# EasyEDA Pro project MSDRV4.eprj, schematic Schematic1_1
Board Name: Board1_1; Create Date: 2025-01-27; Page Name: P1; Project Name: MSDRV4; Schematic Name: Schematic1_1; Update Date: 2025-03-06; Company: EasyEDA.com; Page Size: A4; Version: V1.0
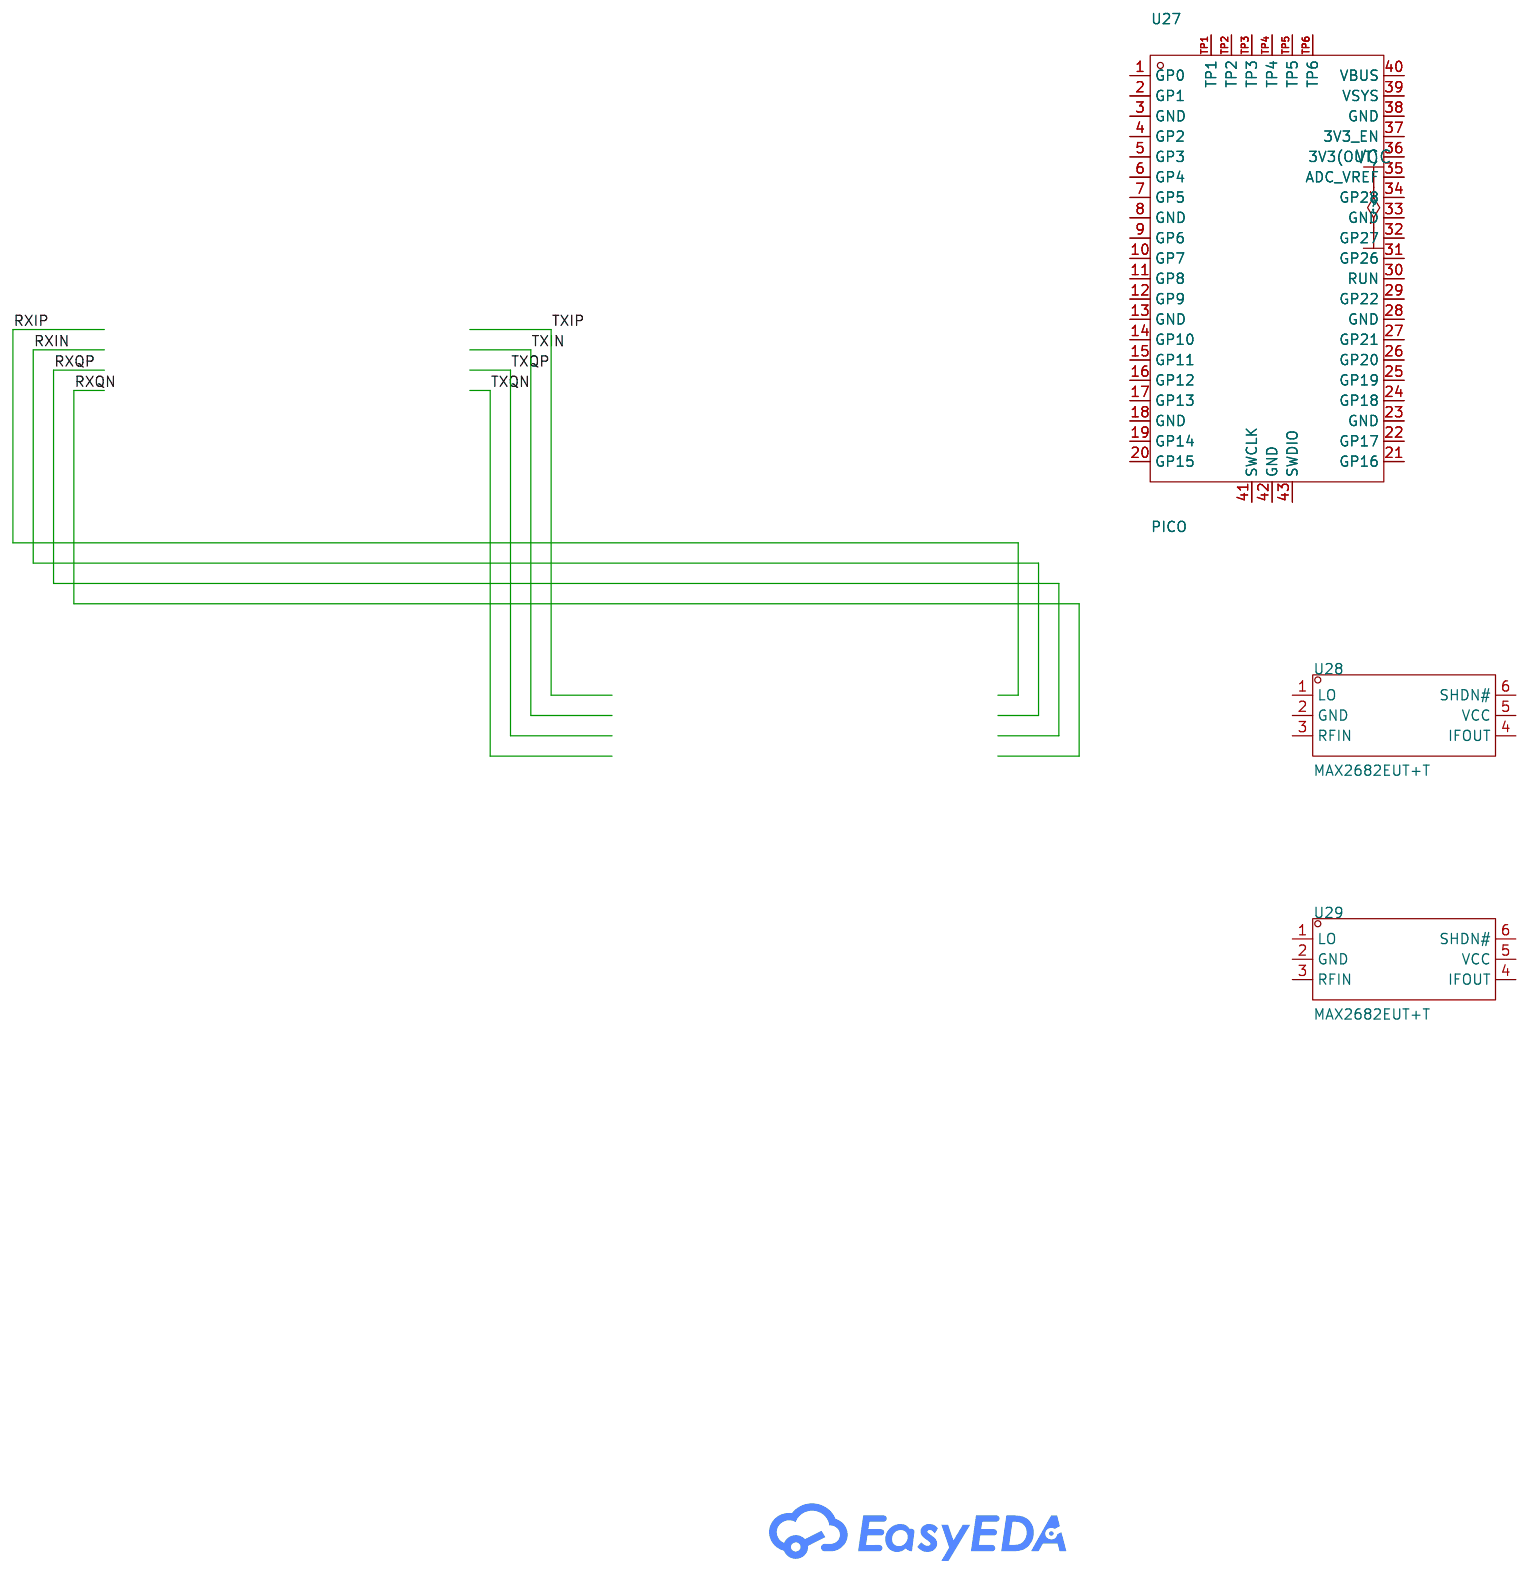
[diagram p3: schematic sheet]

## Parts
CBB1  -
CBB2  -
U27  PICO  [comm-smd_l51.0-w21.0-p2.54_sc0916]
U28  MAX2682EUT+T  [SOT-23-6_L2.9-W1.6-P0.95-LS2.8-TL]
U29  MAX2682EUT+T  [SOT-23-6_L2.9-W1.6-P0.95-LS2.8-TL]

## Library data of the parts
U27 = PICO: Supplier: LCSC; Supplier Part: C7203002; Manufacturer: Raspberry Pi(树莓派); JLCPCB Part Class: Extended Part; Datasheet: https://atta.szlcsc.com/upload/public/pdf/source/20230906/086376002DDC9866828648BC93E51F8B.pdf
U28 U29 = MAX2682EUT+T: LCSC Part Name: 400MHz至2.5GHz、低噪声、SiGe下变频混频器; Supplier Part: C242518; Manufacturer: ADI(亚德诺)/MAXIM(美信); Supplier Footprint: SOT-23-6; JLCPCB Part Class: Extended Part; Datasheet: https://atta.szlcsc.com/upload/public/pdf/source/20180803/C242518_65486365110A18DF443AB56BC6A2A83D.pdf; Supplier: LCSC; Applications: Mobile Phone；PCS；ISM；WLL; Frequency Range: 400MHz~2500MHz; Gain/Loss: 14.7dB; Noise Figure: 6.5dB; Supply Voltage: 2.7V~5.5V; Supply Current: 15mA; Operating Temperature: -40℃~+85℃

## Nets
RXIN: CBB1.(TXQN) CBB2.(REF)

Not connected (* = marked no-connect by the designer): U27 1(GP0) 2(GP1) 3(GND) 4(GP2) 5(GP3) 6(GP4) 7(GP5) 8(GND) 9(GP6) 10(GP7) 11(GP8) 12(GP9) 13(GND) 14(GP10) 15(GP11) 16(GP12) 17(GP13) 18(GND) 19(GP14) 20(GP15) 21(GP16) 22(GP17) 23(GND) 24(GP18) 25(GP19) 26(GP20) 27(GP21) 28(GND) 29(GP22) 30(RUN) 31(GP26) 32(GP27) 33(GND) 34(GP28) 35(ADC_VREF) 36(3V3(OUT)) 37(3V3_EN) 38(GND) 39(VSYS) 40(VBUS) 41(SWCLK) 42(GND) 43(SWDIO) TP1 TP2 TP3 TP4 TP5 TP6; U28 1(LO) 2(GND) 3(RFIN) 4(IFOUT) 5(VCC) 6(SHDN#); U29 1(LO) 2(GND) 3(RFIN) 4(IFOUT) 5(VCC) 6(SHDN#)
